# EAGLE design Pattern Ident v2 (EAGLE 9.4.2)
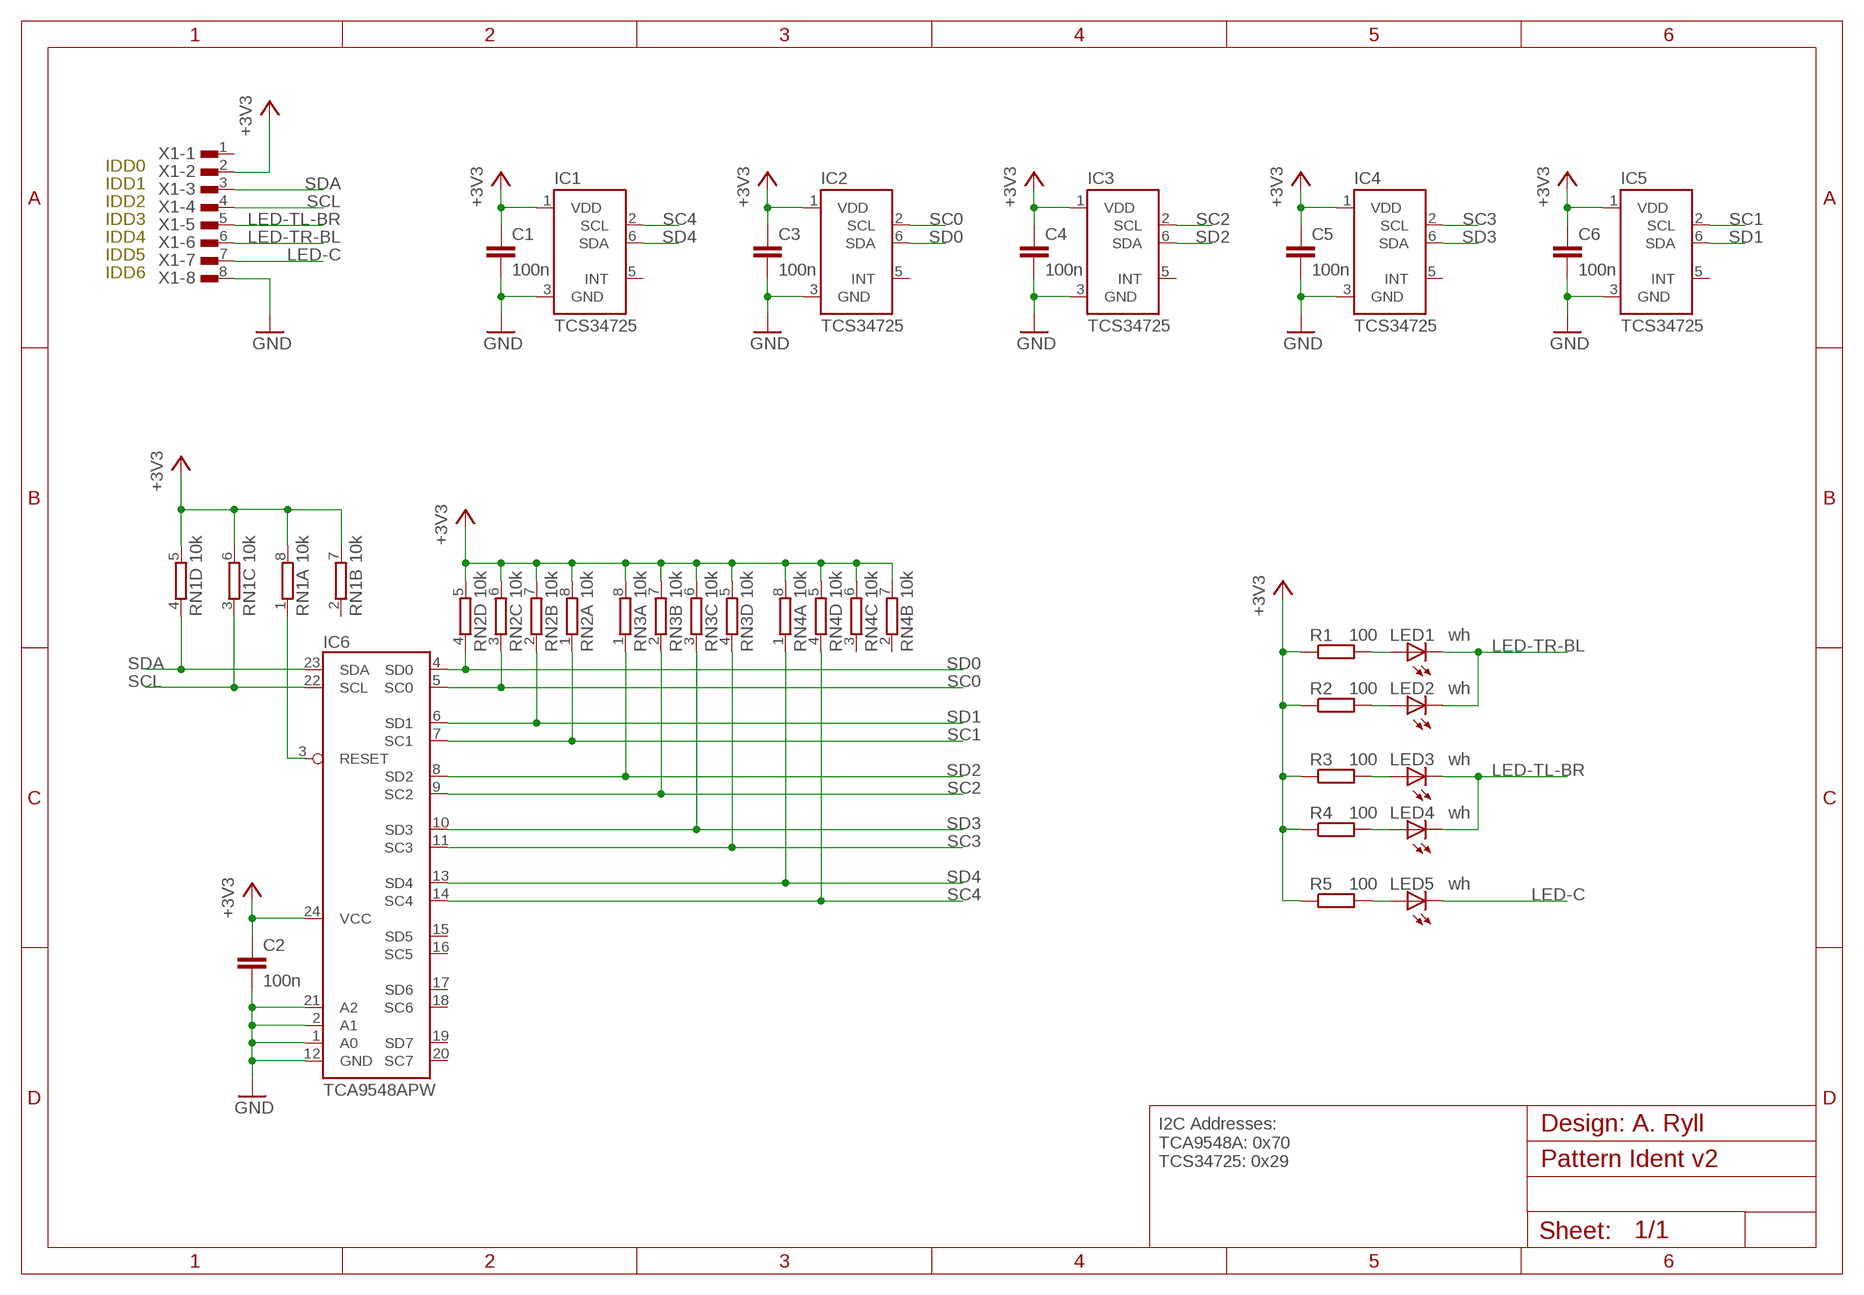
[diagram p0: schematic, sheet 1]

## Parts
C1  100n  C-EUC0603  [C0603]
C2  100n  C-EUC0603  [C0603]
C3  100n  C-EUC0603  [C0603]
C4  100n  C-EUC0603  [C0603]
C5  100n  C-EUC0603  [C0603]
C6  100n  C-EUC0603  [C0603]
IC1  TCS34725  TCS3472  [DFN6]
IC2  TCS34725  TCS3472  [DFN6]
IC3  TCS34725  TCS3472  [DFN6]
IC4  TCS34725  TCS3472  [DFN6]
IC5  TCS34725  TCS3472  [DFN6]
IC6  TCA9548APW  [TSSOP24]
LED1  wh  LEDCHIPLED_1206  [CHIPLED_1206]
LED2  wh  LEDCHIPLED_1206  [CHIPLED_1206]
LED3  wh  LEDCHIPLED_1206  [CHIPLED_1206]
LED4  wh  LEDCHIPLED_1206  [CHIPLED_1206]
LED5  wh  LEDCHIPLED_1206  [CHIPLED_1206]
R1  100  R-EU_R0603  [R0603]
R2  100  R-EU_R0603  [R0603]
R3  100  R-EU_R0603  [R0603]
R4  100  R-EU_R0603  [R0603]
R5  100  R-EU_R0603  [R0603]
RN1  10k  4R-NEXB28V  [EXB28V]
RN2  10k  4R-NEXB28V  [EXB28V]
RN3  10k  4R-NEXB28V  [EXB28V]
RN4  10k  4R-NEXB28V  [EXB28V]
X1  TE-FPC-1MM-8H  [TE-84952-8]

## Nets
+3V3: C1.1 C2.1 C3.1 C4.1 C5.1 C6.1 IC1.1(VDD) IC2.1(VDD) IC3.1(VDD) IC4.1(VDD) IC5.1(VDD) IC6.24(VCC) R1.1 R2.1 R3.1 R4.1 R5.1 RN1.5 RN1.6 RN1.7 RN1.8 RN2.5 RN2.6 RN2.7 RN2.8 RN3.5 RN3.6 RN3.7 RN3.8 RN4.5 RN4.6 RN4.7 RN4.8 X1.2
GND: C1.2 C2.2 C3.2 C4.2 C5.2 C6.2 IC1.3(GND) IC2.3(GND) IC3.3(GND) IC4.3(GND) IC5.3(GND) IC6.1(A0) IC6.2(A1) IC6.12(GND) IC6.21(A2) X1.8
LED-C: LED5.C X1.7
LED-TL-BR: LED3.C LED4.C X1.5
LED-TR-BL: LED1.C LED2.C X1.6
N$12: LED1.A R1.2
N$13: LED2.A R2.2
N$14: LED3.A R3.2
N$15: LED4.A R4.2
N$16: LED5.A R5.2
RESET: IC6.3(RESET) RN1.1
SC0: IC2.2(SCL) IC6.5(SC0) RN2.3
SC1: IC5.2(SCL) IC6.7(SC1) RN2.1
SC2: IC3.2(SCL) IC6.9(SC2) RN3.2
SC3: IC4.2(SCL) IC6.11(SC3) RN3.4
SC4: IC1.2(SCL) IC6.14(SC4) RN4.4
SCL: IC6.22(SCL) RN1.3 X1.4
SD0: IC2.6(SDA) IC6.4(SD0) RN2.4
SD1: IC5.6(SDA) IC6.6(SD1) RN2.2
SD2: IC3.6(SDA) IC6.8(SD2) RN3.1
SD3: IC4.6(SDA) IC6.10(SD3) RN3.3
SD4: IC1.6(SDA) IC6.13(SD4) RN4.1
SDA: IC6.23(SDA) RN1.4 X1.3
Unconnected: IC1.5(INT) IC2.5(INT) IC3.5(INT) IC4.5(INT) IC5.5(INT) IC6.15(SD5) IC6.16(SC5) IC6.17(SD6) IC6.18(SC6) IC6.19(SD7) IC6.20(SC7) RN1.2 RN4.2 RN4.3 X1.1

## Notes on the sheet
- Design: A. Ryll
- I2C Addresses:
  TCA9548A: 0x70
  TCS34725: 0x29

## Library data of the parts
C1-C6 = rcl:C-EU: CAPACITOR, European symbol; SPICEPREFIX: C
IC1-IC5 = TIGERs:TCS3472
IC6 = TIGERs:TCA9548A
LED1-LED5 = led:LED: LED OSRAM: - CHIPLED LG R971, LG N971, LY N971, LG Q971, LY Q971, LO R971, LY R971 LH N974, LH R974 LS Q976, LO Q976, LY Q976 LO Q996 - Hyper CHIPLED LW Q18S LB Q993, LB Q99A, LB R99A - SideLED LS A670, LO A670, LY A670, LG A670, LP A670 LB A673, LV A673, LT A673, LW A673 LH A674 LY A675 LS A676, LA A676, LO A676, LY A676, LW A676 LS A679, LY A679, LG A679 - Hyper Micro SIDELED® LS Y876, LA Y876, LO Y876, LY Y876 LT Y87S - SmartLED LW L88C, LW L88S LB L89C, LB L89S, LG L890 LS L89K, LO L89K, LY L89K LS L896, LA L896, LO L896, LY L896 - TOPLED LS T670, LO T670, LY T670, LG T670, LP T670 LSG T670, LSP T670, LSY T670, LOP T670, LYG T670 LG T671, LOG T671, LSG T671 LB T673, LV T673, LT T673, LW T673 LH T674 LS T676, LA T676, LO T676, LY T676, LB T676, LH T676, LSB T676, LW T676 LB T67C, LV T67C, LT T67C, LS T67K, LO T67K, LY T67K, LW E67C LS E67B, LA E67B, LO E67B, LY E67B, LB E67C, LV E67C, LT E67C LW T67C LS T679, LY T679, LG T679 LS T770, LO T770, LY T770, LG T770, LP T770 LB T773, LV T773, LT T773, LW T773 LH T774 LS E675, LA E675, LY E675, LS T675 LS T776, LA T776, LO T776, LY T776, LB T776 LHGB T686 LT T68C, LB T68C - Hyper Mini TOPLED® LB M676 - Mini TOPLED Santana® LG M470 LS M47K, LO M47K, LY M47K Source: http://www.osram.convergy.de LUXEON: - LUMILED® LXK2-PW12-R00, LXK2-PW12-S00, LXK2-PW14-U00, LXK2-PW14-V00 LXK2-PM12-R00, LXK2-PM12-S00, LXK2-PM14-U00 LXK2-PE12-Q00, LXK2-PE12-R00, LXK2-PE12-S00, LXK2-PE14-T00, LXK2-PE14-U00 LXK2-PB12-K00, LXK2-PB12-L00, LXK2-PB12-M00, LXK2-PB14-N00, LXK2-PB14-P00, LXK2-PB14-Q00 LXK2-PR12-L00, LXK2-PR12-M00, LXK2-PR14-Q00, LXK2-PR14-R00 LXK2-PD12-Q00, LXK2-PD12-R00, LXK2-PD12-S00 LXK2-PH12-R00, LXK2-PH12-S00 LXK2-PL12-P00, LXK2-PL12-Q00, LXK2-PL12-R00 Source: www.luxeon.com KINGBRIGHT: KA-3528ASYC Source: www.kingbright.com
R1-R5 = rcl:R-EU_: RESISTOR, European symbol; SPICEPREFIX: R
RN1-RN4 = resistor-dil:4R-N: Array Chip Resistor Source: RS Component / Phycomp; OC_FARNELL: unknown; OC_NEWARK: unknown
X1 = TIGERs:TE-FPC-1MM-8: TE Connectivity 1.0 FPC, ZIF V/T, SMT, 10P Part Number: 1-1734248-0

## Board
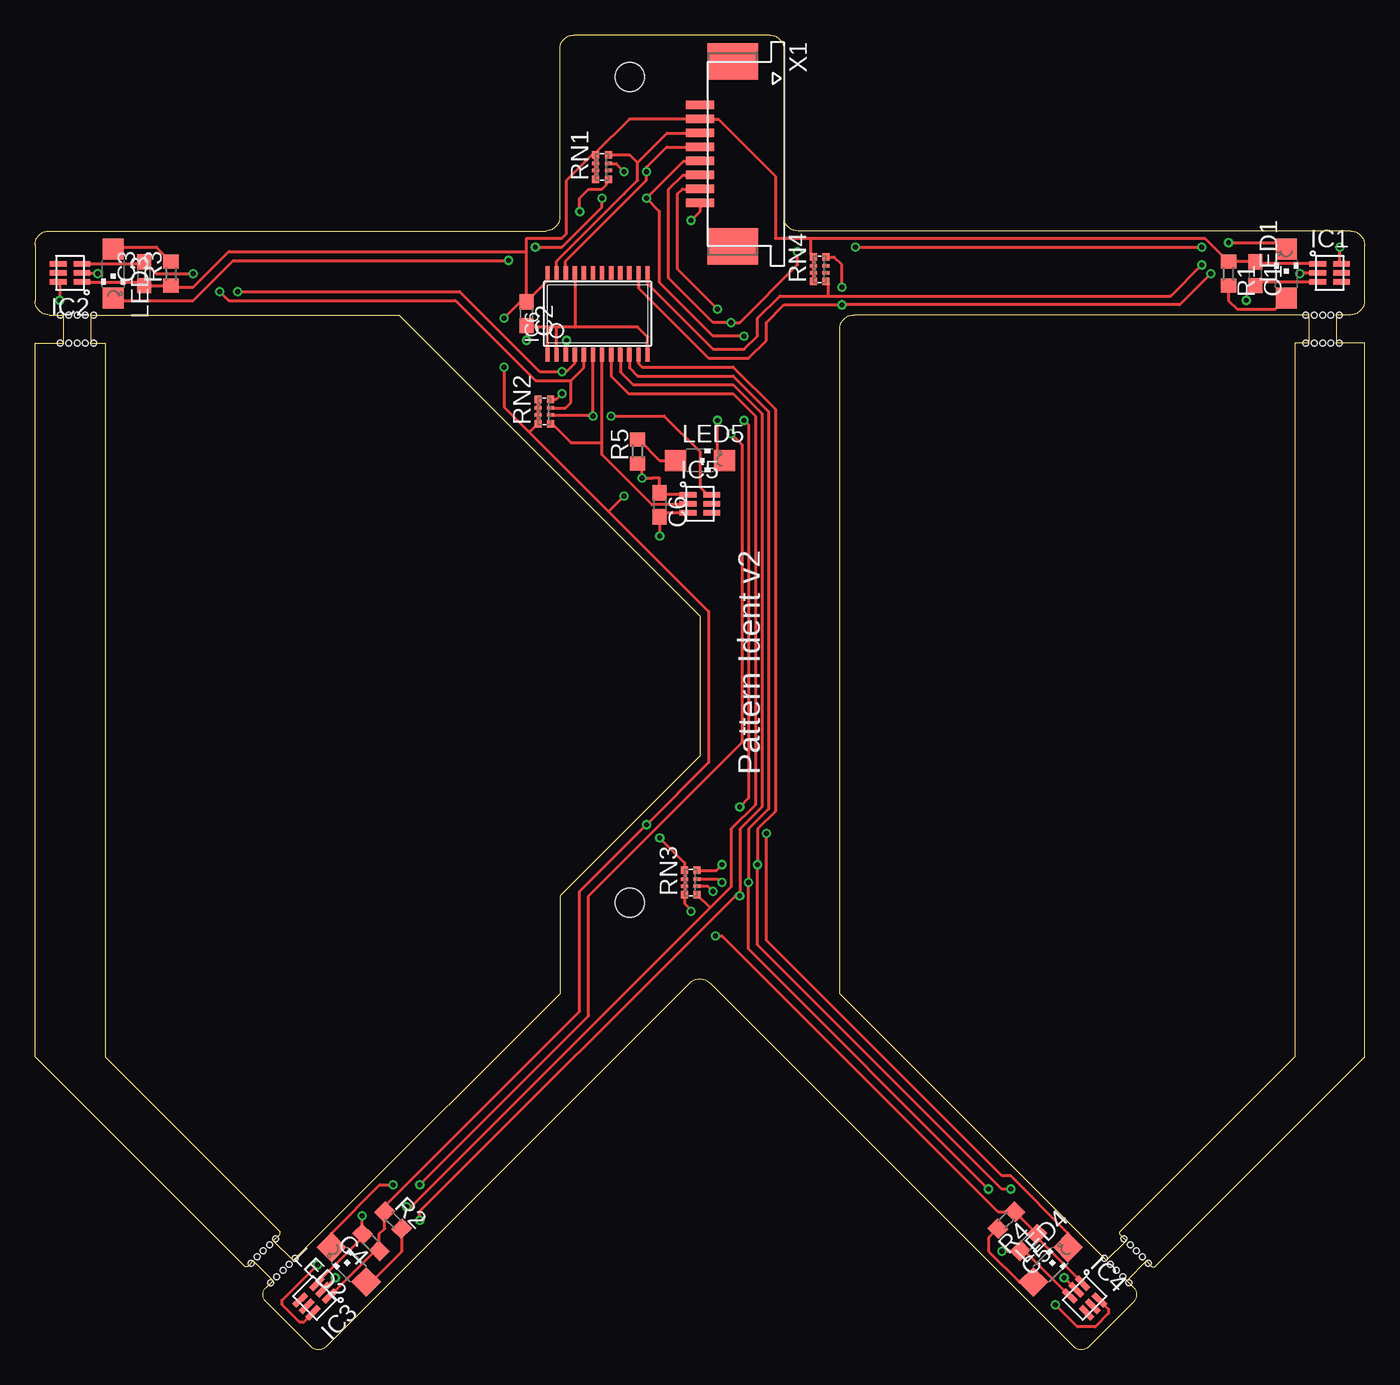
[diagram p1: board, top side]
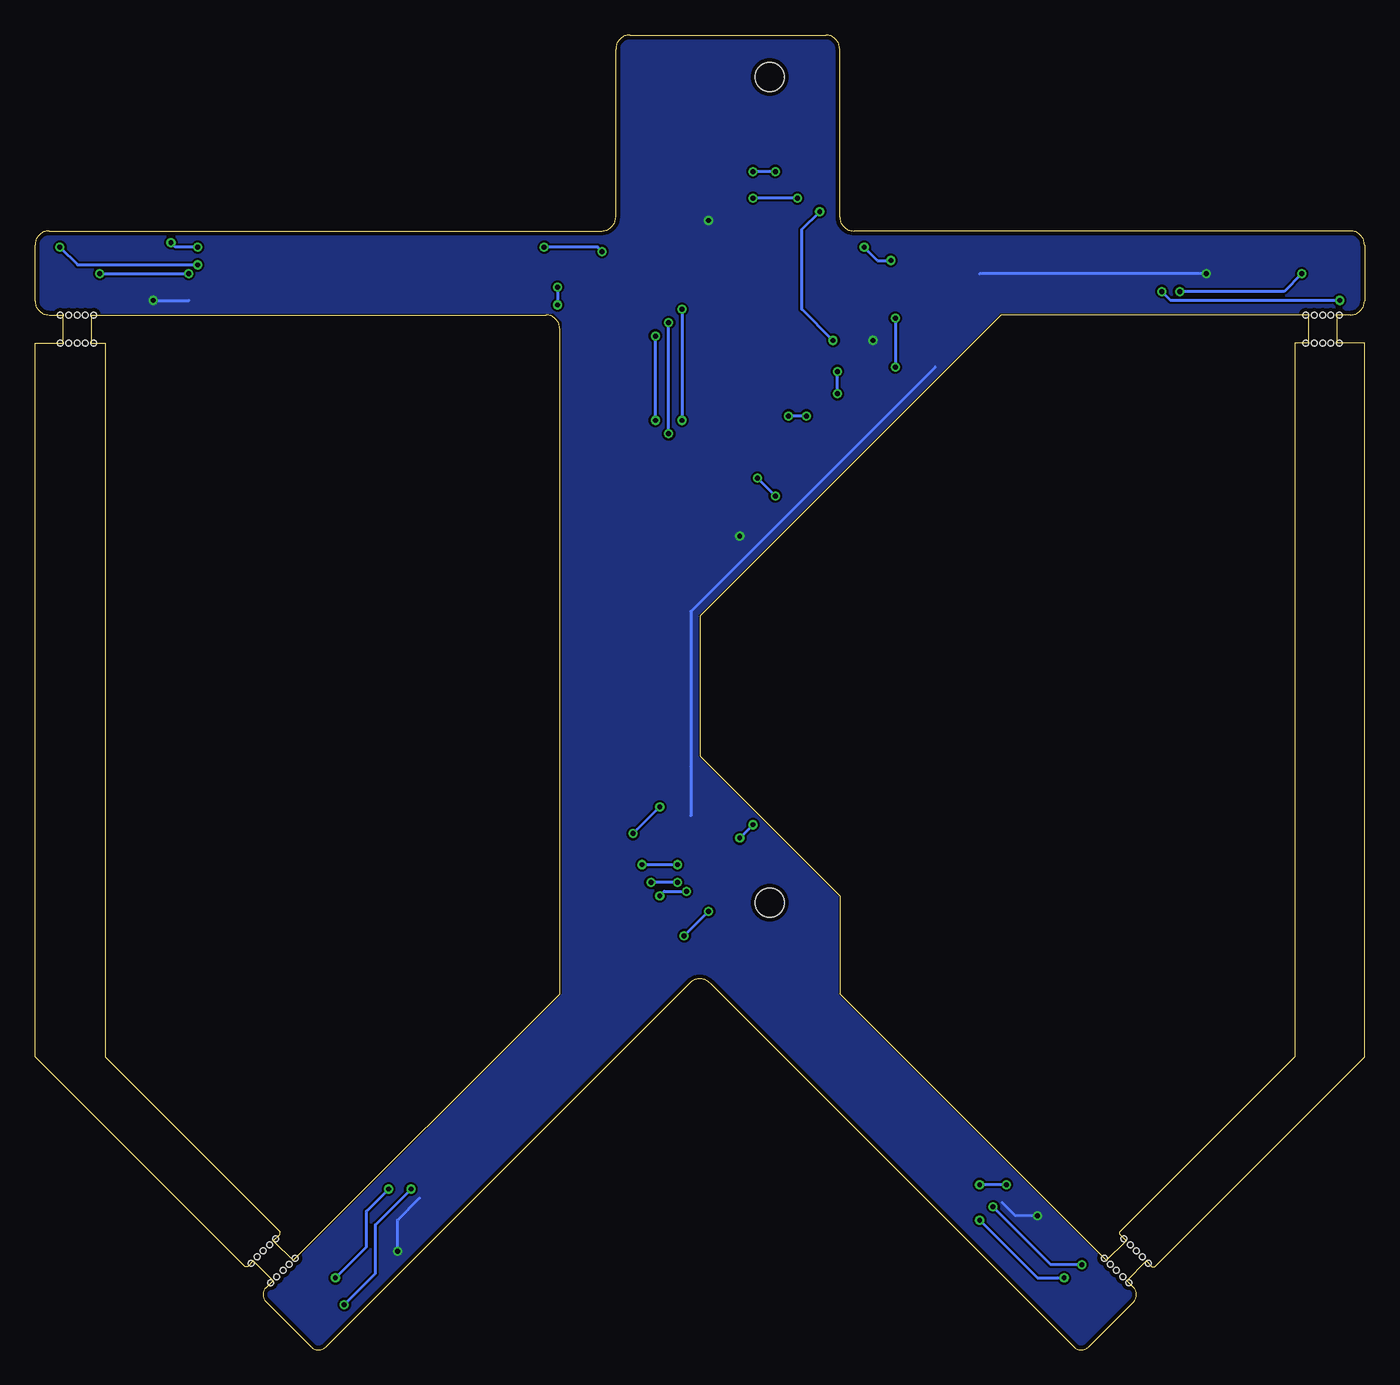
[diagram p2: board, bottom side, seen from below]

Size 95 x 93.96 mm. Coordinates in mm from the lower left corner, seen from the top.
Outline: 75.25,0.21 78.5,3.46 arc90 78.5,4.46 78,4.96 79.41,6.36 79.81,5.96 80,5.96 95,20.96 95,71.96 93,71.96 93,73.96 94,73.96 arc90 95,74.96 95,78.96 arc90 94,79.96 54.5,79.96 arc-90 53.5,80.96 53.5,92.96 arc90 52.5,93.96 38.5,93.96 arc90 37.5,92.96 37.5,80.96 arc-90 36.5,79.96 1,79.96 arc90 0,78.96 0,74.96 arc90 1,73.96 2,73.96 2,71.96 0,71.96 0,20.96 15,5.96 15.19,5.96 15.59,6.36 17,4.96 16.5,4.46 arc90 16.5,3.46 19.75,0.21 arc90 20.75,0.21 46.75,26.21 arc-90 48.25,26.21 74.25,0.21 arc90 75.25,0.21
Copper layers (1*16): Top 0.035mm / dielectric 1.5mm / Bottom 0.035mm
Design rules "PCB-POOL Standard": minimum track width 0.15mm, minimum drill 0.3mm, track to track 0.15mm, track to pad 0.15mm, pad to pad 0.15mm, via to via 0.15mm, smd to smd 0.15mm, copper to edge 0.3mm, drill to drill 0.2mm, minimum pad ring 0.2mm, minimum via ring 0.15mm, stop-mask expansion 0.075mm, vias tented up to drill 0mil, thermal gap 0.2mm
Holes 2.1 mm at 42.5,90.96 42.5,31.96
Holes 0.4 mm at 3,71.96 3.6,71.96 4.2,71.96 2.4,71.96 1.8,71.96 3,73.96 3.6,73.96 4.2,73.96 2.4,73.96 1.8,73.96 92,71.96 92.6,71.96 93.2,71.96 91.4,71.96 90.8,71.96 92,73.96 92.6,73.96 93.2,73.96 91.4,73.96 90.8,73.96 16.84,4.8 17.28,5.24 17.72,5.68 18.16,6.11 18.59,6.55 15.44,6.21 15.88,6.64 16.31,7.08 16.75,7.52 17.19,7.96 79.56,6.21 79.12,6.64 78.69,7.08 78.25,7.52 77.81,7.96 78.16,4.8 77.72,5.24 77.28,5.68 76.84,6.11 76.41,6.55
tKeepout: area 40.5,30 to 44.5,34; area 40.5,89 to 44.5,93
Milling: 26 lines

### Footprints (pad centres in the part's own frame; a part is rotated, then mirrored left to right if it is on the bottom)
C0603 = smd 1.1 x 1: 1 -0.85,0; 2 0.85,0
DFN6 = smd 1.2 x 0.4: 1 -0.85,0.65; 2 -0.85,0; 3 -0.85,-0.65; 4 0.85,-0.65; 5 0.85,0; 6 0.85,0.65
TSSOP24 = smd 0.305 x 0.991: 1 -3.575,-2.918; 2 -2.925,-2.918; 3 -2.275,-2.918; 4 -1.625,-2.918; 5 -0.975,-2.918; 6 -0.325,-2.918; 7 0.325,-2.918; 8 0.975,-2.918; 9 1.625,-2.918; 10 2.275,-2.918; 11 2.925,-2.918; 12 3.575,-2.918; 13 3.575,2.918; 14 2.925,2.918; 15 2.275,2.918; 16 1.625,2.918; 17 0.975,2.918; 18 0.325,2.918; 19 -0.325,2.918; 20 -0.975,2.918; 21 -1.625,2.918; 22 -2.275,2.918; 23 -2.925,2.918; 24 -3.575,2.918
CHIPLED_1206 = smd 1.5 x 1.5: A 0,-1.75; C 0,1.75
R0603 = smd 1 x 1.1: 1 -0.85,0; 2 0.85,0
EXB28V = smd 0.525 x 0.5: 1 -0.875,-0.45; 4 0.875,-0.45; 5 0.875,0.45; 8 -0.875,0.45 | smd 0.25 x 0.5: 2 -0.25,-0.45; 3 0.25,-0.45; 6 0.25,0.45; 7 -0.25,0.45
TE-84952-8 = smd 0.6 x 2: 1 -3.5,-6; 2 -2.5,-6; 3 -1.5,-6; 4 -0.5,-6; 5 0.5,-6; 6 1.5,-6; 7 2.5,-6; 8 3.5,-6 | smd 2.6 x 3.6: G1 -6.6,-3.65; G2 6.6,-3.65

### Placement (x,y rotation side)
C1  87.19,76.9 270 top
C2  35.12,74.04 270 top
C3  7.81,76.9 90 top
C4  24,7.68 135 top
C5  71,7.68 225 top
C6  44.64,60.39 270 top
IC1  92.5,76.96 0 top
IC2  2.5,76.96 180 top
IC3  20,3.71 225 top
IC4  75,3.71 315 top
IC5  47.5,60.46 0 top
IC6  40.2,74.04 0 top
LED1  89.41,76.9 0 top
LED2  22.42,6.09 45 top
LED3  5.59,76.9 180 top
LED4  72.58,6.09 315 top
LED5  47.5,63.56 270 top
R1  85.28,76.9 270 top
R2  25.59,9.27 315 top
R3  9.72,76.9 90 top
R4  69.41,9.27 225 top
R5  43.05,64.2 90 top
RN1  40.52,84.52 90 top
RN2  36.39,67.05 90 top
RN3  46.87,33.4 90 top
RN4  56.07,77.21 90 top
X1  53.5,85.46 270 top

### Tracks (layer width: path | path; a pad name or v marks a point on that pad's centre or on a via)
+3V3  (via drill 0.35)
  Top 0.203: IC2.1 7.55,76.31 C3.1 R3.1 9.82,75.94 11.3,75.94 13.84,78.48 35.12,78.48 | C2.1 36.62,76.39 IC6.24 | IC5.1 44.77,61.11 C6.1 44.64,62.29 44.11,62.29 v43.37,62.29 43.37,63.03 R5.1 | 55.44,79.44 52.9,79.44 52.9,83.88 48.82,87.96 X1.2 42.48,87.96 39.99,85.47 RN1.5 | C2.1 35.12,78.48 | 35.12,78.48 35.12,79.44 37.66,79.44 37.98,79.75 37.98,83.56 39.8,85.39 RN1.5 | C2.1 34.7,74.89 v33.53,73.72 | RN1.8 RN1.7 RN1.6 RN1.5 | RN4.8 RN4.7 RN4.6 RN4.5 55.44,78.27 55.44,79.44 | v33.53,70.23 33.53,67.37 35.28,65.63 | 40.99,59.91 v42.1,61.02 | 35.28,65.63 40.99,59.91 | 40.99,59.91 48.13,52.77 48.13,41.97 v43.69,37.53 43.37,37.21 38.93,32.76 38.93,24.19 24.99,10.26 R2.1 24.99,8.67 24.61,8.28 C4.1 24.29,7.08 IC3.1 | 35.28,65.63 35.38,65.63 RN2.8 RN2.7 RN2.6 RN2.5 | v44.64,36.57 46.41,34.8 RN3.5 RN3.6 RN3.7 RN3.8 46.41,31.89 46.87,31.44 v46.87,31.34 | IC4.1 71.6,8.03 C5.1 R4.1 68.81,9.87 49.09,29.59 v48.61,29.59 | IC1.1 87.33,77.61 C1.1 R1.1 83.59,79.44 55.44,79.44
  Bottom 0.203: v33.53,73.72 v33.53,70.23 | v42.1,61.02 v43.37,62.29 | v43.69,37.53 v44.64,36.57 | v48.61,29.59 v46.87,31.34
GND  (via drill 0.35)
  Top 0.203: IC2.3 7.67,77.61 C3.2 8.66,76.9 v11.3,76.9 | IC6.12 43.77,72.37 43.05,73.09 38.61,73.09 | 38.61,73.09 37.34,73.09 | 37.34,73.09 36.7,73.09 | IC6.2 37.27,73.09 37.34,73.09 | IC6.1 36.62,73.09 36.7,73.09 | IC6.21 38.57,73.09 38.61,73.09 | IC5.3 44.91,59.81 C6.2 v44.64,58.16 | 36.7,73.09 35.22,73.09 C2.2 v35.12,72.13 | X1.8 47.5,81.34 v46.87,80.71 | IC3.3 23.4,8.03 C4.2 23.37,8.32 v23.37,9.59 | IC4.3 70.71,7.08 C5.2 70.36,7.05 v69.09,7.05 | IC1.3 87.45,76.31 C1.2 86.55,75.41 v86.55,74.99
  Bottom 0.203: 30.67,70.23 48.13,52.77 48.13,41.65 48.13,38.16 | v11.3,76.9 27.5,76.9 | v23.37,9.59 24.96,9.59 25.91,10.54 | v69.09,7.05 69.09,9.27 67.5,10.86 | v86.55,74.99 84.01,74.99
  pour Bottom: -0.5,94.96 95.5,94.96 95.5,-1.04 -0.5,-1.04
  cutout Bottom: 0,73.96 26,73.96 47.5,52.46 47.5,42.46 37.5,32.46 37.5,25.46 16,3.96 0,19.96
  cutout Bottom: 95,73.96 58,73.96 57.5,73.46 57.5,25.46 79,3.96 95,19.96
LED-C  (via drill 0.35)
  Top 0.203: LED5.C 48.77,64.04 v48.77,66.42 | v48.77,74.36 45.91,77.21 45.91,82.61 46.26,82.96 X1.7
  Bottom 0.203: v48.77,74.36 v48.77,66.42
LED-TL-BR  (via drill 0.35)
  Top 0.203: LED3.C 5.74,74.99 11.3,74.99 14.16,77.85 v33.85,77.85 | v50.67,66.42 50.99,66.1 50.99,39.43 v50.36,38.8 | v35.75,78.8 37.66,78.8 40.52,81.66 v40.52,82.29 | X1.5 46.35,84.96 v43.69,82.29 44.64,81.34 44.64,76.26 48.45,72.45 v50.67,72.45 | v52.26,36.89 52.26,29.27 69.09,12.44 69.72,12.44 73.82,8.35 LED4.C 73.82,7.71
  Bottom 0.203: v50.67,66.42 v50.67,72.45 | v35.75,78.8 34.8,77.85 v33.85,77.85 | v40.52,82.29 v43.69,82.29 | v50.36,38.8 v52.26,36.89
LED-TR-BL  (via drill 0.35)
  Top 0.203: v49.72,65.47 50.52,64.67 50.52,43.4 39.56,32.45 39.56,23.87 v27.5,11.81 | X1.6 46.3,83.96 45.28,82.93 45.28,76.58 48.45,73.4 v49.72,73.4 50.36,73.4 54.48,77.53 v54.48,78.48 | LED2.C 21.18,8.35 24.64,11.81 v25.59,11.81 | v85.28,79.12 88.94,79.12 LED1.C | v58.61,78.8 v83.38,78.8
  Bottom 0.203: v49.72,65.47 v49.72,73.4 | v54.48,78.48 54.8,78.8 v58.61,78.8 | v25.59,11.81 v27.5,11.81 | v83.38,78.8 84.97,78.8 v85.28,79.12
N$12
  Top 0.203: R1.2 85.28,74.99 85.92,74.36 88.62,74.36 LED1.A
N$13
  Top 0.203: R2.2 26.19,7.01 24.04,4.86 LED2.A
N$14
  Top 0.203: LED3.A 5.74,78.8 8.66,78.8 R3.2
N$15
  Top 0.203: R4.2 68.14,8 68.14,7.05 70.33,4.86 LED4.A
N$16
  Top 0.203: R5.2 43.16,65.05 44.64,63.56 LED5.A
RESET  (via drill 0.35)
  Top 0.203: IC6.3 37.92,72.08 v37.98,72.13 | v38.93,81.34 38.93,82.29 39.56,82.93 40.52,82.93 40.83,83.25 40.83,83.51 RN1.1
  Bottom 0.203: v37.98,72.13 40.2,74.36 40.2,80.07 v38.93,81.34
SC0  (via drill 0.35)
  Top 0.203: IC2.2 4.42,76.96 v4.48,76.9 | v13.21,75.63 13.84,74.99 30.04,74.99 35.75,69.28 38.29,69.28 | IC6.5 39.22,70.21 38.29,69.28 | RN2.3 37.91,67.3 38.29,67.69 38.29,69.28
  Bottom 0.203: v4.48,76.9 5.75,75.63 v13.21,75.63
SC1
  Top 0.203: IC5.2 46.58,60.39 44.09,60.39 40.52,63.96 40.52,64.83 | IC6.7 40.52,64.83 | RN2.1 36.95,66.18 38.29,64.83 40.52,64.83
SC2  (via drill 0.35)
  Top 0.203: IC6.9 41.82,69.87 42.74,68.96 49.88,68.96 51.95,66.9 51.95,38.8 50.36,37.21 v50.36,32.45 50.04,32.45 27.5,9.9 v27.5,9.27 | RN3.2 48.07,33.15 v48.45,32.76 | IC3.2 21.43,5.14 v21.46,5.14
  Bottom 0.203: v50.36,32.45 50.04,32.76 v48.45,32.76 | v27.5,9.27 23.37,5.14 v21.46,5.14
SC3  (via drill 0.35)
  Top 0.203: IC6.11 43.12,70.48 43.37,70.23 49.88,70.23 52.9,67.21 52.9,38.48 51.63,37.21 v51.63,34.67 51.63,28.95 69.09,11.49 v69.72,11.49 | RN3.4 48.69,34.27 v49.09,34.67 | IC4.2 73.56,5.14 v73.53,5.14
  Bottom 0.203: v49.09,34.67 v51.63,34.67 | v73.53,5.14 71.31,7.36 71.31,9.9 v69.72,11.49
SC4  (via drill 0.35)
  Top 0.203: IC6.14 43.12,75.88 48.13,70.86 50.99,70.86 52.26,72.13 52.26,73.4 53.53,74.67 v57.66,74.67 81.79,74.67 v84.01,76.9 | v57.66,75.94 57.66,77.53 57.1,78.09 RN4.4 | IC1.2 90.42,76.96 v90.36,76.9
  Bottom 0.203: v57.66,75.94 v57.66,74.67 | v90.36,76.9 v84.01,76.9
SCL  (via drill 0.35)
  Top 0.203: IC6.22 37.92,77.8 43.69,83.56 v43.69,84.2 43.69,84.52 45.13,85.96 X1.4 | RN1.3 41.53,84.77 v42.1,84.2
  Bottom 0.203: v42.1,84.2 v43.69,84.2
SD0  (via drill 0.35)
  Top 0.203: IC2.6 1.78,76.18 v1.78,74.99 | IC6.4 38.57,70.51 37.98,69.91 v37.66,69.91 36.07,69.91 30.36,75.63 v14.48,75.63 | RN2.4 37.26,67.93 v37.66,68.32
  Bottom 0.203: v1.78,74.99 13.84,74.99 v14.48,75.63 | v37.66,68.32 v37.66,69.91
SD1  (via drill 0.35)
  Top 0.203: IC6.6 v39.88,66.74 39.88,66.8 RN2.2 | IC5.6 48.05,61.11 47.5,61.66 47.5,64.2 44.96,66.74 v41.15,66.74
  Bottom 0.203: v39.88,66.74 v41.15,66.74
SD2  (via drill 0.35)
  Top 0.203: IC6.8 41.17,69.57 42.42,68.32 49.88,68.32 51.47,66.74 51.47,38.96 49.72,37.21 49.72,33.08 48.21,31.57 | IC3.6 19.18,1.97 18.93,1.97 17.66,3.24 17.66,3.55 v20.2,6.09 | v26.55,10.22 26.86,10.22 48.21,31.57 | 48.21,31.57 48.21,31.62 RN3.1
  Bottom 0.203: v20.2,6.09 22.42,6.09 v26.55,10.22
SD3  (via drill 0.35)
  Top 0.203: IC6.10 42.47,70.18 43.05,69.59 49.88,69.59 52.42,67.05 52.42,38.64 50.99,37.21 v50.99,33.4 50.99,28.64 v68.14,11.49 | RN3.3 48.84,33.65 v49.09,33.4 | IC4.6 76.71,2.92 76.71,2.6 75.76,1.65 74.49,1.65 v72.9,3.24
  Bottom 0.203: v49.09,33.4 v50.99,33.4 | v72.9,3.24 70.68,5.46 70.68,8.95 v68.14,11.49
SD4  (via drill 0.35)
  Top 0.203: IC6.13 43.77,76.18 48.45,71.5 50.67,71.5 51.63,72.45 51.63,73.72 53.22,75.31 56.71,75.31 | 56.71,75.31 56.71,76.15 RN4.1 | IC1.6 93.22,77.74 v93.22,78.8 | v83.38,77.53 81.16,75.31 56.71,75.31
  Bottom 0.203: v93.22,78.8 91.95,77.53 90.05,77.53 v83.38,77.53
SDA
  Top 0.203: IC6.23 37.27,77.78 42.1,82.61 43.05,83.56 43.05,84.83 | X1.3 45.18,86.96 43.05,84.83 | RN1.4 42.5,85.39 43.05,84.83

### Text on the board
tPlace: Pattern Ident v2